# Altium schematic sheet JHZ-E01S-HW-Sensor-X2-S0.1-磁编码器AS5047-20160919.SchDoc
size A4
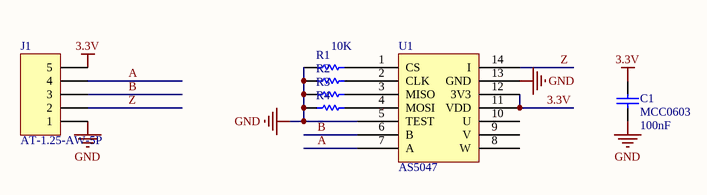
[diagram p0: JHZ-E01S-HW-Sensor-X2-S0.1-磁编码器AS5047-20160919.SchDoc]

## Parts
C1  MCC0603  value 100nF  [C0603_M1608]
J1  AT-1.25-AW-5P  [AT-1.25-AW-5P]
R1  value 10K  [R0603_M1608]  (hidden comment: R0603_M1608)
R2  R0603_M1608  [R0603_M1608]  (value not drawn)
R3  R0603_M1608  [R0603_M1608]  (value not drawn)
R4  R0603_M1608  [R0603_M1608]  (value not drawn)
U1  AS5047  [TSSOP14_065P]

## Nets
3.3V: C1.1 J1.5 U1.11(VDD) U1.12(3V3)
GND: C1.2 J1.1 R1.1 R2.1 R3.1 R4.1 U1.5(TEST) U1.13(GND)
A: J1.4 U1.7(A)
B: J1.3 U1.6(B)
Z: J1.2 U1.14(I)
NetR1_2: R1.2 U1.1(CS)
NetR2_2: R2.2 U1.2(CLK)
NetR3_2: R3.2 U1.3(MISO)
NetR4_2: R4.2 U1.4(MOSI)

Not connected (* = marked no-connect by the designer): U1 8(W) 9(V) 10(U)

## Library data of the parts
C1 = MCC0603: Multilayer Ceramic Capacitor 0603
J1 = 1.25T-1-A-5P: Header, 1.25mm,5-Pin; Value: AT-1.25-AW-5P
R1 = R0603_M1608: Resistor
R2-R4 = R0603_M1608: Resistor; Value: 10K